# Altium schematic sheet MCU.SchDoc
size A; SheetNumber: 3
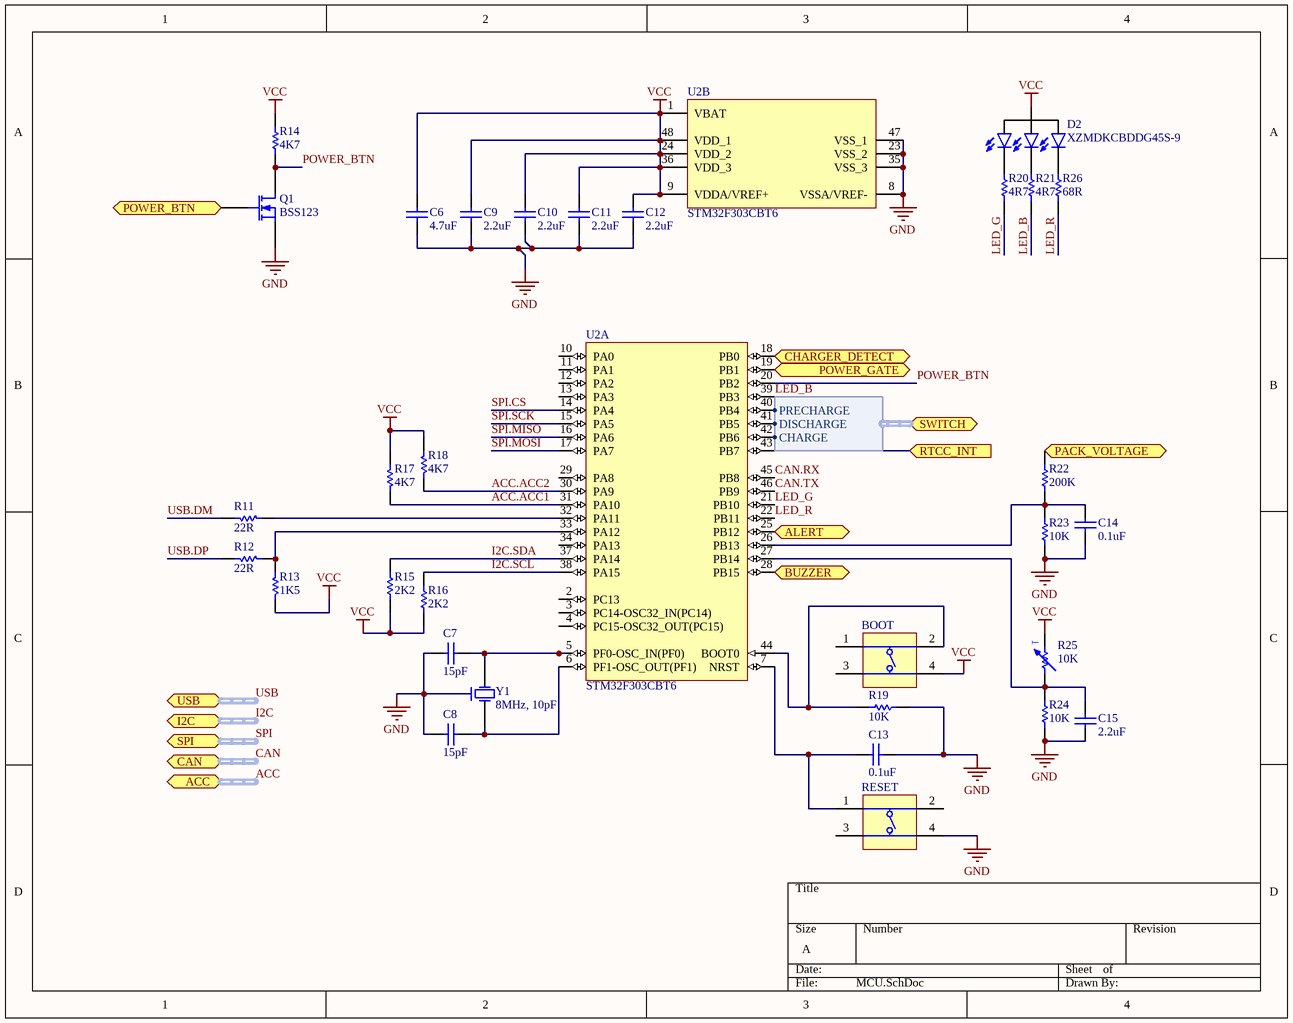
[diagram p0: MCU.SchDoc]

## Parts
BOOT  (no value)  [SWITCH]
C6  value 4.7uF  [C0402[1005X55]]  (hidden comment: 4.7uF 6.3V 0402)
C7  value 15pF  [C0402[1005X55]]  (hidden comment: 15pF 50V 0402)
C8  value 15pF  [C0402[1005X55]]  (hidden comment: 15pF 50V 0402)
C9  value 2.2uF  [C0402[1005X55]]  (hidden comment: 2.2uF 6.3V 0402)
C10  value 2.2uF  [C0402[1005X55]]  (hidden comment: 2.2uF 6.3V 0402)
C11  value 2.2uF  [C0402[1005X55]]  (hidden comment: 2.2uF 6.3V 0402)
C12  value 2.2uF  [C0402[1005X55]]  (hidden comment: 2.2uF 6.3V 0402)
C13  value 0.1uF  [C0402[1005X55]]  (hidden comment: 0.1uF 6.3V 0402)
C14  value 0.1uF  [C0402[1005X55]]  (hidden comment: 0.1uF 6.3V 0402)
C15  value 2.2uF  [C0402[1005X55]]  (hidden comment: 2.2uF 6.3V 0402)
D2  XZMDKCBDDG45S-9  [XZMDKCBDDG45S-9]
Q1  BSS123  [SOT323-3]
R11  value 22R  [R0402[1005]]  (hidden comment: 22R 1% 0402)
R12  value 22R  [R0402[1005]]  (hidden comment: 22R 1% 0402)
R13  value 1K5  [R0402[1005]]  (hidden comment: 1K5 1% 0402)
R14  value 4K7  [R0402[1005]]  (hidden comment: 4K7 1% 0402)
R15  value 2K2  [R0402[1005]]  (hidden comment: 2K2 1% 0402)
R16  value 2K2  [R0402[1005]]  (hidden comment: 2K2 1% 0402)
R17  value 4K7  [R0402[1005]]  (hidden comment: 4K7 1% 0402)
R18  value 4K7  [R0402[1005]]  (hidden comment: 4K7 1% 0402)
R19  value 10K  [R0402[1005]]  (hidden comment: 10K 1% 0402)
R20  value 4R7  [R0402[1005]]  (hidden comment: 4R7 1% 0402)
R21  value 4R7  [R0402[1005]]  (hidden comment: 4R7 1% 0402)
R22  value 200K  [R0402[1005]]  (hidden comment: 200K 1% 0402)
R23  value 10K  [R0402[1005]]  (hidden comment: 10K 1% 0402)
R24  value 10K  [R0402[1005]]  (hidden comment: 10K 1% 0402)
R25  value 10K  [R0402[1005]]  (hidden comment: 10K 0.5% 0402)
R26  value 68R  [R0402[1005]]  (hidden comment: 68R 1% 0402)
RESET  (no value)  [SWITCH]
U2  STM32F303CBT6  [LQFP-48]  (parts A,B of 2)
Y1  8MHz, 10pF  [ABRA-ABM3B-4_V]

## Ports
ACC (harness Accessory Outputs), ALERT (in), BUZZER (out), CAN (harness CAN Input), CHARGER_DETECT (in), I2C (harness I2C), PACK_VOLTAGE (in), POWER_BTN (in), POWER_GATE (out), RTCC_INT (in), SPI (harness SPI), SWITCH (harness Switches), USB (harness USB)

## Harnesses
Switches: CHARGE, DISCHARGE, PRECHARGE

## Nets
GND: C6.1 C7.1 C8.1 C9.1 C10.1 C11.1 C12.1 C13.2 C14.1 C15.1 Q1.2(S) R19.2 R23.1 R24.1 RESET.4(T3) U2.8(VSSA/VREF-) U2.23(VSS_2) U2.35(VSS_3) U2.47(VSS_1) Y1.2
VCC: BOOT.4(T3) C6.2 C9.2 C10.2 C11.2 C12.2 D2.2(A) R13.1 R14.2 R15.2 R16.2 R17.2 R18.2 R25.2 U2.1(VBAT) U2.9(VDDA/VREF+) U2.24(VDD_2) U2.36(VDD_3) U2.48(VDD_1)
ACC.ACC1: R17.1 U2.31(PA10)
ACC.ACC2: R18.1 U2.30(PA9)
ALERT: U2.25(PB12) ; port ALERT
BUZZER: U2.28(PB15) ; port BUZZER
CAN.RX: U2.45(PB8)
CAN.TX: U2.46(PB9)
CHARGER_DETECT: U2.18(PB0) ; port CHARGER_DETECT
I2C.SCL: R16.1 U2.38(PA15)
I2C.SDA: R15.1 U2.37(PA14)
LED_B: R21.1 U2.39(PB3)
LED_G: R20.1 U2.21(PB10)
LED_R: R26.1 U2.22(PB11)
PACK_VOLTAGE: R22.1 ; port PACK_VOLTAGE
POWER_BTN: Q1.3(D) R14.1 U2.20(PB2)
POWER_BTN: Q1.1(G) ; port POWER_BTN  [a separate net that carries the same name]
POWER_GATE: U2.19(PB1) ; port POWER_GATE
RTCC_INT: U2.43(PB7) ; port RTCC_INT
SPI.CS: U2.14(PA4)
SPI.MISO: U2.16(PA6)
SPI.MOSI: U2.17(PA7)
SPI.SCK: U2.15(PA5)
USB.DM: R11.2
USB.DP: R12.2
NetBOOT_2: BOOT.2(T2) R19.1 U2.44(BOOT0)
NetC7_2: C7.2 U2.5(PF0-OSC_IN(PF0)) Y1.1(X1)
NetC8_2: C8.2 U2.6(PF1-OSC_OUT(PF1)) Y1.3(X2)
NetC13_1: C13.1 RESET.1(T1) U2.7(NRST)
NetC14_2: C14.2 R22.2 R23.2 U2.26(PB13)
NetC15_2: C15.2 R24.2 R25.1 U2.27(PB14)
NetD2_1: D2.1(K_Red) R26.2
NetD2_3: D2.3(K_Blue) R21.2
NetD2_4: D2.4(K_Green) R20.2
NetR11_1: R11.1 U2.32(PA11)
NetR12_1: R12.1 R13.2 U2.33(PA12)
NetU2_40: U2.40(PB4) ; port SWITCH.PRECHARGE
NetU2_41: U2.41(PB5) ; port SWITCH.DISCHARGE
NetU2_42: U2.42(PB6) ; port SWITCH.CHARGE

Not connected (* = marked no-connect by the designer): BOOT 1(T1) 3(T3); RESET 2(T2) 3(T3); U2 2(PC13) 3(PC14-OSC32_IN(PC14)) 4(PC15-OSC32_OUT(PC15)) 10(PA0) 11(PA1) 12(PA2) 13(PA3) 29(PA8) 34(PA13)

## Buses and harness runs
harness ACC = port ACC
harness CAN = port CAN
harness I2C = port I2C
harness SPI = port SPI
harness USB = port USB

## Notes on the sheet
- (in symbol NTC_10K_0402_0.5%) T

## Library data of the parts
BOOT RESET = DIPT-DTSM-6: Switch, SPNO Push Button SMD; Manufacturer: C&K Components; PartNumber: PTS810 SJM 250 SMTR LFS; Packing Type: Tape&Reel; Mechanical Life: 200,000 cycles; ComponentLink2URL: http://www.dip.com.tw/Products_tact.htm; ComponentLink1URL: http://www.dip.com.tw/; ComponentLink3URL: http://www.dip.com.tw/PDF/pro_tact/DTSM_G_-6_2_-V.pdf; PackageDescription: Switch, Surface Mount, 4 Leads, Body 4.6x2.8mm, Height 1.9mm; ComponentLink2Description: Datasheet; ComponentLink3Description: Package Specification; ComponentLink1Description: Manufacturer URL; PackageReference: PTS810; Mounting Technology: Surface Mount
C6 = CAP_4.7uF_6.3V_0402_20%: 4.7uF 6.3V 20% 0402 (1005 Metric); PartNumber: GRM155R60J475ME47D; Manufacturer: Murata; Tolerance: 20%; Mounting Technology: Surface Mount; PackageReference: 0402; PackageDescription: 0402 (1005 Metric); Voltage: 6.3V
C7 C8 = CAP_15pF_50V_0402_5%: 15pF 50V 5% 0402 (1005 Metric); PartNumber: GRM1555C1H150JA01D; Manufacturer: Murata; Tolerance: 5%; Mounting Technology: Surface Mount; PackageReference: 0402; PackageDescription: 0402 (1005 Metric); Voltage: 50V
C9-C12 C15 = CAP_2.2uF_6.3V_0402_20%: 2.2uF 6.3V 20% 0402 (1005 Metric); PartNumber: GRM155R60J225ME15D; Manufacturer: Murata; Tolerance: 20%; Mounting Technology: Surface Mount; PackageReference: 0402; PackageDescription: 0402 (1005 Metric); Voltage: 6.3V
C13 C14 = CAP_0.1uF_6.3V_0402_10%: 0.1uF 6.3V 10% 0402 (1005 Metric); PartNumber: GRM155R70J104KA01D; Manufacturer: Murata; Tolerance: 10%; Mounting Technology: Surface Mount; PackageReference: 0402; PackageDescription: 0402 (1005 Metric); Voltage: 6.3V
D2 = XZMDKCBDDG45S-9: Manufacturer: SunLED; PartNumber: XZMDKCBDDG45S-9; PackageReference: 4-PLCC; Mounting Technology: Surface Mount; PackageDescription: 4-SMD, Gull Wing,  3.20mm L x 2.80mm W
Q1 = BSS123WQ-7-F: N-Channel MOSFET; Manufacturer: Diodes Incorporated; PackageReference: SOT-323-3; PartNumber: BSS123WQ-7-F; Mounting Technology: Surface Mount
R11 R12 = RES_22R_0402_1%: 22R 0.063W 1% 0402 (1005 Metric); Manufacturer: KOA Speer; PartNumber: RK73H1ETTP22R0F; Power: 0.063W; Tolerance: 1%; Mounting Technology: Surface Mount; PackageReference: 0402; PackageDescription: 0402 (1005 Metric); ComponentLink1Description: Datasheet; ComponentLink1URL: http://www.koaspeer.com/catimages/Products/RK73H/RK73H.pdf
R13 = RES_1K5_0402_1%: 1K5 0.063W 1% 0402 (1005 Metric); Manufacturer: KOA Speer; PartNumber: RK73H1ETTP1501F; Tolerance: 1%; Power: 0.063W; Mounting Technology: Surface Mount; PackageReference: 0402; PackageDescription: 0402 (1005 Metric); ComponentLink1Description: Datasheet; ComponentLink1URL: http://www.koaspeer.com/catimages/Products/RK73H/RK73H.pdf
R14 R17 R18 = RES_4K7_0402_1%: 4K7 0.063W 1% 0402 (1005 Metric); Manufacturer: KOA Speer; PartNumber: RK73H1ETTP4701F; Tolerance: 1%; Power: 0.063W; Mounting Technology: Surface Mount; PackageReference: 0402; PackageDescription: 0402 (1005 Metric); ComponentLink1Description: Datasheet; ComponentLink1URL: http://www.koaspeer.com/catimages/Products/RK73H/RK73H.pdf
R15 R16 = RES_2K2_0402_1%: 2K2 0.063W 1% 0402 (1005 Metric); Manufacturer: KOA Speer; PartNumber: RK73H1ETTP2201F; Tolerance: 1%; Power: 0.063W; Mounting Technology: Surface Mount; PackageReference: 0402; PackageDescription: 0402 (1005 Metric); ComponentLink1Description: Datasheet; ComponentLink1URL: http://www.koaspeer.com/catimages/Products/RK73H/RK73H.pdf
R19 R23 R24 = RES_10K_0402_1%: 10K 0.063W 1% 0402 (1005 Metric); Manufacturer: KOA Speer; PartNumber: RK73H1ETTP1002F; Tolerance: 1%; Power: 0.063W; Mounting Technology: Surface Mount; PackageReference: 0402; PackageDescription: 0402 (1005 Metric); ComponentLink1Description: Datasheet; ComponentLink1URL: http://www.koaspeer.com/catimages/Products/RK73H/RK73H.pdf
R20 R21 = RES_4R7_0402_1%: 4R7 0.063W 1% 0402 (1005 Metric); Manufacturer: KOA Speer; PartNumber: RK73H1ETTP4R70F; Power: 0.063W; Tolerance: 1%; Mounting Technology: Surface Mount; PackageReference: 0402; PackageDescription: 0402 (1005 Metric); ComponentLink1Description: Datasheet; ComponentLink1URL: http://www.koaspeer.com/catimages/Products/RK73H/RK73H.pdf
R22 = RES_200K_0402_1%: 200K 0.063W 1% 0402 (1005 Metric); Manufacturer: KOA Speer; PartNumber: RK73H1ETTP2003F; Tolerance: 1%; Power: 0.063W; Mounting Technology: Surface Mount; PackageReference: 0402; PackageDescription: 0402 (1005 Metric); ComponentLink1Description: Datasheet; ComponentLink1URL: http://www.koaspeer.com/catimages/Products/RK73H/RK73H.pdf
R25 = NTC_10K_0402_0.5%: NTC 10K 0.5% 0402 (1005 Metric); PartNumber: NCP15XH103D03RC; Manufacturer: Murata; Power: 0.1W; Tolerance: 0.5%; Mounting Technology: Surface Mount; PackageReference: 0402; PackageDescription: 0402 (1005 Metric)
R26 = RES_68R_0402_1%: 68R 0.063W 1% 0402 (1005 Metric); Manufacturer: KOA Speer; PartNumber: RK73H1ETTP68R0F; Tolerance: 1%; Power: 0.063W; Mounting Technology: Surface Mount; PackageReference: 0402; PackageDescription: 0402 (1005 Metric); ComponentLink1Description: Datasheet; ComponentLink1URL: http://www.koaspeer.com/catimages/Products/RK73H/RK73H.pdf
U2 = STM32F303CBT6: Manufacturer: STMicroelectronics; PackageReference: LQFP-48; Mounting Technology: Surface Mount; PartNumber: STM32F303CBT6; PackageDescription: QFP, 48-Leads, Body 7x7mm, Pitch 0.5mm
Y1 = ABRA-ABM3B-4: PartNumber: ABM3B-8.000MHZ-10-1UT; Manufacturer: ABRACON; Mounting Technology: Surface Mount; PackageReference: 2012; PackageDescription: 2012 (5032 metric)